# EAGLE schematic Esquematico_Layout - Projeto (EAGLE 9.7.0)
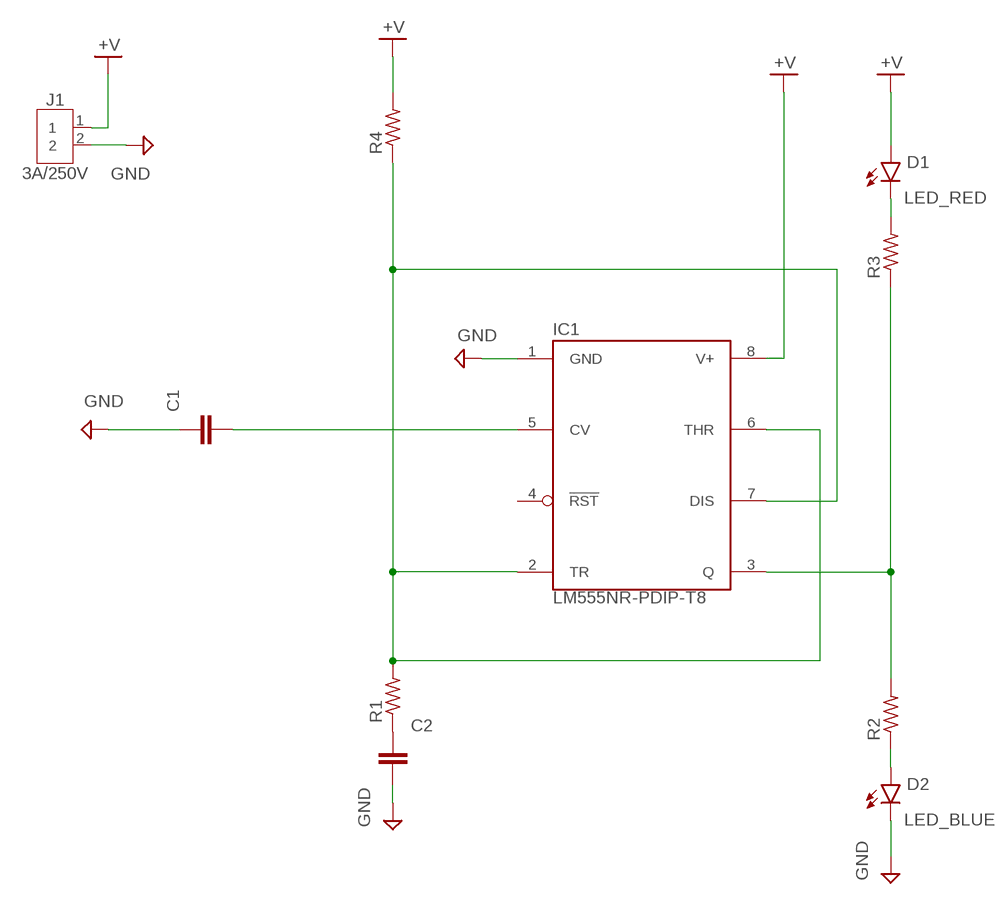
[diagram p0: schematic, sheet 1]

## Parts
C1  C_RADIAL-12.5MM-DIA  [CAPRD550W60D1025H1250B]
C2  C_RADIAL-12.5MM-DIA  [CAPRD550W60D1025H1250B]
D1  LED_RED  LED_RADIAL_RED  [LEDRD254W60D565H860B]
D2  LED_BLUE  LED_RADIAL_BLUE  [LEDRD254W60D565H860B_B]
IC1  LM555NR-PDIP-T8  [P(R-PDIP-T8)]
J1  3A/250V  B2B-XH-A  [B2B-XH-A]
R1  R-US_AXIAL-7.2MM-PITCH  [RESAD724W46L381D178B]
R2  R-US_AXIAL-7.2MM-PITCH  [RESAD724W46L381D178B]
R3  R-US_AXIAL-7.2MM-PITCH  [RESAD724W46L381D178B]
R4  R-US_AXIAL-7.2MM-PITCH  [RESAD724W46L381D178B]

## Nets
+V: D1.1(A) IC1.8(V+) J1.1 R4.2
GND: C1.1 C2.2 D2.2(C) IC1.1(GND) J1.2
N$1: C1.2 IC1.5(CV)
N$2: IC1.2(TR) IC1.6(THR) IC1.7(DIS) R1.2 R4.1
N$4: IC1.3(Q) R2.2 R3.1
N$5: D1.2(C) R3.2
N$6: D2.1(A) R2.1
N$7: C2.1 R1.1
Unconnected: IC1.4(!RST)

## Library data of the parts
C1 C2 = Tutorial - Fusion 360:C: Capacitor - Generic; CATEGORY: Capacitor
D1 D2 = Opto-Electronic:LED_RADIAL: LED - Generic; CATEGORY: Opto-Electronic; SUB-CATEGORY: LED
IC1 = Tutorial - Fusion 360:LM555N
J1 = Connector:B2B-XH-A: XH Connector Top Entry - 2POS Details see: Datasheet <http://www.jst-mfg.com/product/pdf/eng/eXH.pdf>; CATEGORY: CONNECTOR; DESCRIPTION: 2.5mm pitch/disconnectable crimp style connector; MANUFACTURER: JST (XH CONNECTOR); MPN: B2B-XH-A; OPERATING_TEMPERATURE: -25°C ~ 85°C; PART_STATUS: ACTIVE; ROHS_COMPLIANT: COMPLIANT; SERIES: B_B-XH-A; SUB_CATEGORY: Through hole connector; TYPE: top entry
R1-R4 = Tutorial - Fusion 360:R-US: Resistor Fixed - ANSI; CATEGORY: Resistor; SUB-CATEGORY: Fixed